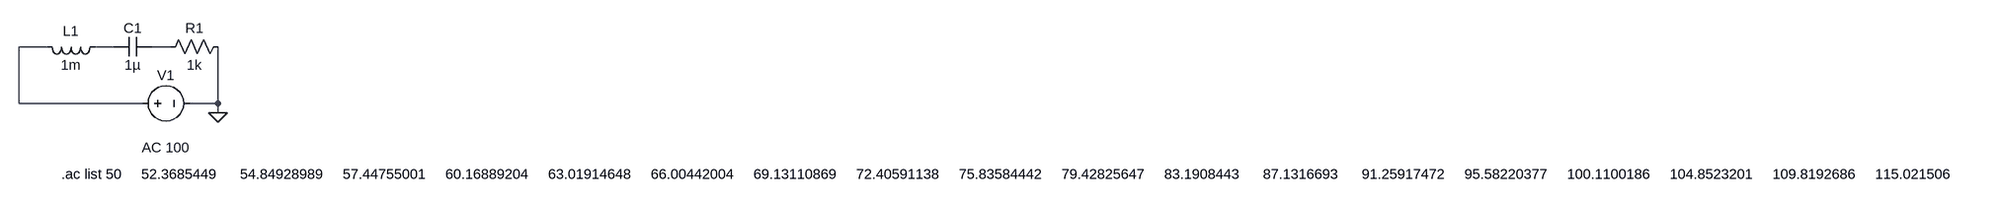
[diagram p0: schematic ac_band_pass_filter.asc]
ac_band_pass_filter.asc, the LTspice schematic file:
Version 4
SHEET 1 34184 680
WIRE 64 80 16 80
WIRE 176 80 144 80
WIRE 272 80 240 80
WIRE 16 176 16 80
WIRE 224 176 16 176
WIRE 352 176 352 80
WIRE 352 176 304 176
WIRE 352 192 352 176
FLAG 352 192 0
SYMBOL voltage 208 176 R270
WINDOW 0 32 56 VTop 2
WINDOW 3 -32 56 VBottom 2
WINDOW 123 -60 56 VBottom 2
WINDOW 39 0 0 Left 2
SYMATTR InstName V1
SYMATTR Value ""
SYMATTR Value2 AC 100
SYMBOL res 368 64 R90
WINDOW 0 0 56 VBottom 2
WINDOW 3 32 56 VTop 2
SYMATTR InstName R1
SYMATTR Value 1k
SYMBOL cap 240 64 R90
WINDOW 0 0 32 VBottom 2
WINDOW 3 32 32 VTop 2
SYMATTR InstName C1
SYMATTR Value 1µ
SYMBOL ind 160 64 R90
WINDOW 0 5 56 VBottom 2
WINDOW 3 32 56 VTop 2
SYMATTR InstName L1
SYMATTR Value 1m
TEXT 88 296 Left 2 !.ac list 50     52.3685449      54.84928989     57.44755001     60.16889204     63.01914648     66.00442004     69.13110869     72.40591138     75.83584442     79.42825647     83.1908443      87.1316693      91.25917472     95.58220377     100.1100186     104.8523201     109.8192686     115.021506      120.470178      126.1769585     132.1540743     138.4143315     144.9711427     151.8385559     159.0312846     166.5647394     174.4550607     182.7191535     191.3747239     200.4403164     209.9353542     219.8801805     230.2961021     241.2054352     252.6315533     264.5989368     277.133226      290.2612758     304.0112131     318.4124972     333.4959832     349.2939873     365.8403572     383.1705434     401.3216761     420.3326443     440.2441791     461.0989412     482.9416121     505.8189899     529.7800896     554.8762482     581.1612343     608.6913639     637.5256204     667.7257815     699.3565513     732.4856992     767.1842045     803.5264091     841.5901767     881.457059      923.2124714     966.9458752     1012.75097      1060.725892     1110.97343      1163.601239     1218.722075     1276.454034     1336.920808     1400.251947     1466.583139     1536.056499     1608.820875     1685.032165     1764.853651     1848.456354     1936.019391     2027.730368     2123.785776     2224.391416     2329.762834     2440.125792     2555.716742     2676.783339     2803.584969     2936.393307     3075.492894     3221.181754     3373.772027     3533.590637     3700.979998     3876.298744     4059.922497     4252.244671     4453.677319     4664.652013     4885.620768     5117.057011     5359.456596     5613.338868     5879.24777      6157.753016     6449.451306     6754.967606     7074.956487     7410.103529     7761.126787     8128.778332     8513.845861     8917.154385     9339.567995     9781.991718     10245.37345     10730.70599     11239.02917     11771.43207     12329.05538     12913.0938      13524.79865     14165.48051     14836.51204     15539.33094     16275.443       17046.42535     17853.92982     18699.68651     19585.50745     20513.29053     21485.02352     22502.78838     23568.76567     24685.23926     25854.60121     27079.35689     28362.13034     29705.66992     31112.85418     32586.69802     34130.35917     35747.14493     37440.51929     39214.11031     41071.71792     43017.32208     45055.09126     47189.39139     49424.79523     51766.09216     54218.29843     56786.66792     59476.70337     62294.16821     65245.0989      68335.81782     71572.94688     74963.42164     78514.50624     82233.8089      86129.29827     90209.32047     94482.61698     98958.34339     103646.089      108555.8973     113698.2876     119084.2776     124725.4068     130633.7613     136821.9999     143303.3808     150091.7907     157201.7736     164648.5628     172448.113      180617.135      189173.1309     198134.4319     207520.2379     217350.6579     227646.7537     238430.5849     249725.2558     261554.9654     273945.059      286922.0824     300513.8391     314749.4495     329659.4136     345275.676      361631.6948     378762.5129     396704.8333     415497.0975     435179.5681     455794.415      477385.8057     500000

The netlist it stands for:
* ac_band_pass_filter.asc
V1 N001 0 AC 100
R1 0 N003 1k
C1 N003 N002 1µ
L1 N002 N001 1m
.ac list 50     52.3685449      54.84928989     57.44755001     60.16889204     63.01914648     66.00442004     69.13110869     72.40591138     75.83584442     79.42825647     83.1908443      87.1316693      91.25917472     95.58220377     100.1100186     104.8523201     109.8192686     115.021506      120.470178      126.1769585     132.1540743     138.4143315     144.9711427     151.8385559     159.0312846     166.5647394     174.4550607     182.7191535     191.3747239     200.4403164     209.9353542     219.8801805     230.2961021     241.2054352     252.6315533     264.5989368     277.133226      290.2612758     304.0112131     318.4124972     333.4959832     349.2939873     365.8403572     383.1705434     401.3216761     420.3326443     440.2441791     461.0989412     482.9416121     505.8189899     529.7800896     554.8762482     581.1612343     608.6913639     637.5256204     667.7257815     699.3565513     732.4856992     767.1842045     803.5264091     841.5901767     881.457059      923.2124714     966.9458752     1012.75097      1060.725892     1110.97343      1163.601239     1218.722075     1276.454034     1336.920808     1400.251947     1466.583139     1536.056499     1608.820875     1685.032165     1764.853651     1848.456354     1936.019391     2027.730368     2123.785776     2224.391416     2329.762834     2440.125792     2555.716742     2676.783339     2803.584969     2936.393307     3075.492894     3221.181754     3373.772027     3533.590637     3700.979998     3876.298744     4059.922497     4252.244671     4453.677319     4664.652013     4885.620768     5117.057011     5359.456596     5613.338868     5879.24777      6157.753016     6449.451306     6754.967606     7074.956487     7410.103529     7761.126787     8128.778332     8513.845861     8917.154385     9339.567995     9781.991718     10245.37345     10730.70599     11239.02917     11771.43207     12329.05538     12913.0938      13524.79865     14165.48051     14836.51204     15539.33094     16275.443       17046.42535     17853.92982     18699.68651     19585.50745     20513.29053     21485.02352     22502.78838     23568.76567     24685.23926     25854.60121     27079.35689     28362.13034     29705.66992     31112.85418     32586.69802     34130.35917     35747.14493     37440.51929     39214.11031     41071.71792     43017.32208     45055.09126     47189.39139     49424.79523     51766.09216     54218.29843     56786.66792     59476.70337     62294.16821     65245.0989      68335.81782     71572.94688     74963.42164     78514.50624     82233.8089      86129.29827     90209.32047     94482.61698     98958.34339     103646.089      108555.8973     113698.2876     119084.2776     124725.4068     130633.7613     136821.9999     143303.3808     150091.7907     157201.7736     164648.5628     172448.113      180617.135      189173.1309     198134.4319     207520.2379     217350.6579     227646.7537     238430.5849     249725.2558     261554.9654     273945.059      286922.0824     300513.8391     314749.4495     329659.4136     345275.676      361631.6948     378762.5129     396704.8333     415497.0975     435179.5681     455794.415      477385.8057     500000
.backanno
.end